# EAGLE design burnerindicator (EAGLE 7.2.0)
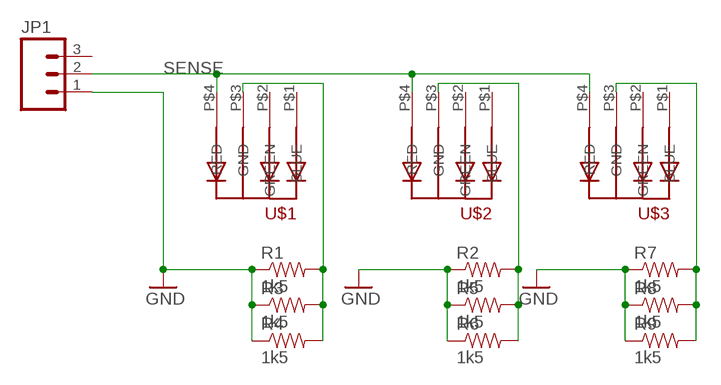
[diagram p0: schematic, sheet 1]

## Parts
JP1  M03POLAR_LOCK  [MOLEX-1X3_LOCK]
R1  1k5  RESISTOR0603-RES  [0603-RES]
R2  1k5  RESISTOR0603-RES  [0603-RES]
R3  1k5  RESISTOR0603-RES  [0603-RES]
R4  1k5  RESISTOR0603-RES  [0603-RES]
R5  1k5  RESISTOR0603-RES  [0603-RES]
R6  1k5  RESISTOR0603-RES  [0603-RES]
R7  1k5  RESISTOR0603-RES  [0603-RES]
R8  1k5  RESISTOR0603-RES  [0603-RES]
R9  1k5  RESISTOR0603-RES  [0603-RES]
U$1  5MMRGBLED  [LED5MMRGB]
U$2  5MMRGBLED  [LED5MMRGB]
U$3  5MMRGBLED  [LED5MMRGB]

## Nets
GND: JP1.1 R1.1 R2.1 R3.1 R4.1 R5.1 R6.1 R7.1 R8.1 R9.1
N$1: R1.2 R3.2 R4.2 U$1.P$3(GND)
N$2: R2.2 R5.2 R6.2 U$2.P$3(GND)
N$3: R7.2 R8.2 R9.2 U$3.P$3(GND)
SENSE: JP1.2 U$1.P$4(RED) U$2.P$4(RED) U$3.P$4(RED)
Unconnected: JP1.3 U$1.P$1(BLUE) U$1.P$2(GREEN) U$2.P$1(BLUE) U$2.P$2(GREEN) U$3.P$1(BLUE) U$3.P$2(GREEN)

## Library data of the parts
JP1 = SparkFun:M03: Header 3 Standard 3-pin 0.1" header. Use with straight break away headers (SKU : PRT-00116), right angle break away headers (PRT-00553), swiss pins (PRT-00743), machine pins (PRT-00117), and female headers (PRT-00115). Molex polarized connector foot print use with SKU : PRT-08232 with associated crimp pins and housings.
R1-R9 = SparkFun:RESISTOR: Resistor Basic schematic elements and footprints for 0603, 1206, and PTH 1/10th watt (small) resistors.
U$1-U$3 = led_rgb:5MMRGBLED

## Board
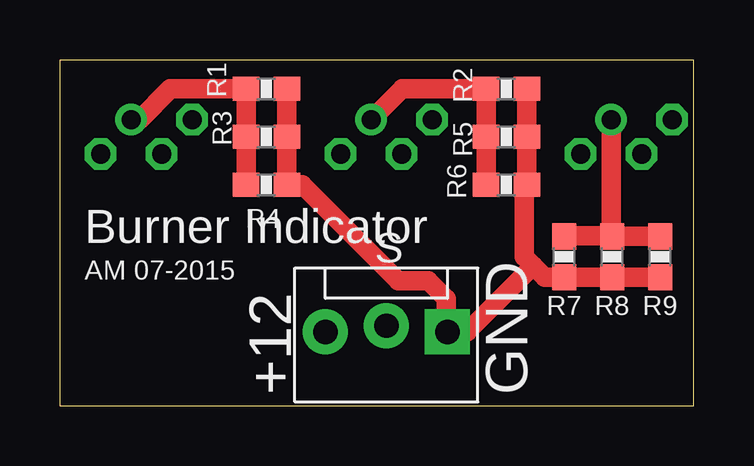
[diagram p1: board, top side]
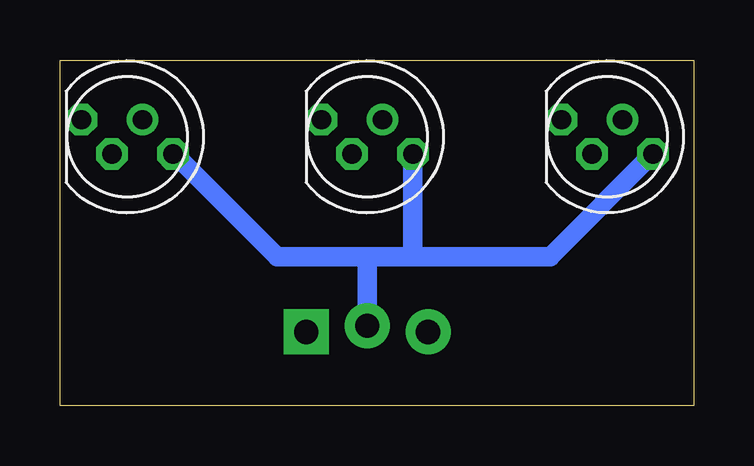
[diagram p2: board, bottom side, seen from below]

Size 26.4 x 14.4 mm. Coordinates in mm from the lower left corner, seen from the top.
Outline: 0,14.4 0,0 26.4,0 26.4,14.4 0,14.4
Copper layers (1*16): Top 0.035mm / dielectric 1.5mm / Bottom 0.035mm
Design rules "mill *": minimum track width 6mil, minimum drill 12mil, track to track 6mil, track to pad 6mil, pad to pad 6mil, via to via 6mil, smd to smd 0mil, copper to edge 10mil, drill to drill 10mil, minimum pad ring 10mil, minimum via ring 6mil, stop-mask expansion 2mil, vias tented up to drill 100mil, thermal gap 10mil

### Footprints (pad centres in the part's own frame; a part is rotated, then mirrored left to right if it is on the bottom)
MOLEX-1X3_LOCK = drill 1.016 pad 1.88 square: 1 0,0.127 | drill 1.016 pad 1.88: 2 2.54,-0.127; 3 5.08,0.127
0603-RES = smd 1.1 x 1: 1 -0.85,0; 2 0.85,0
LED5MMRGB = drill 0.8 pad 0.813 octagon: P$1 -1.905,0.714; P$2 -0.635,-0.714; P$4 1.905,-0.714 | drill 0.8 pad 0.813: P$3 0.635,0.714

### Placement (x,y rotation side)
JP1  16.14,3.2 180 top
R1  8.6,13.2 180 top
R2  18.6,13.2 180 top
R3  8.6,11.2 180 top
R4  8.6,9.2 180 top
R5  18.6,11.2 180 top
R6  18.6,9.2 180 top
R7  21,6.2 90 top
R8  23,6.2 90 top
R9  25,6.2 90 top
U$1  3.6,11.2 0 bottom
U$2  13.6,11.2 0 bottom
U$3  23.6,11.2 0 bottom

### Tracks (layer width: path | path; a pad name or v marks a point on that pad's centre or on a via)
GND
  Top 0.813: R1.1 R3.1 R4.1 10.1,9.2 14.1,5.2 15.35,5.2 16.1,4.45 16.1,3.11 JP1.1 16.97,3.07 19.73,5.83 | R2.1 R5.1 R6.1 19.35,9.1 19.35,6.2 19.73,5.83 | R9.1 R8.1 R7.1 20.2,5.35 19.73,5.83
N$1
  Top 0.813: U$1.P$3 3.31,11.91 4.6,13.2 R1.2 R3.2 R4.2
N$2
  Top 0.813: U$2.P$3 14.25,13.2 R2.2 R5.2 R6.2
N$3
  Top 0.813: U$3.P$3 22.96,7.08 | 22.96,7.08 R8.2 R9.2 | 22.96,7.08 21.04,7.08 R7.2
SENSE
  Bottom 0.813: U$3.P$4 21.64,10.49 17.35,6.2 13.6,6.2 | 13.6,6.2 11.6,6.2 | 11.6,6.2 5.98,6.2 U$1.P$4 | U$2.P$4 11.7,6.29 11.6,6.2 | JP1.2 13.6,6.2

### Text on the board
tNames: Burner Indicator | S | AM 07-2015 | +12 | GND